# EAGLE design mippe_base (EAGLE 9.4.2)
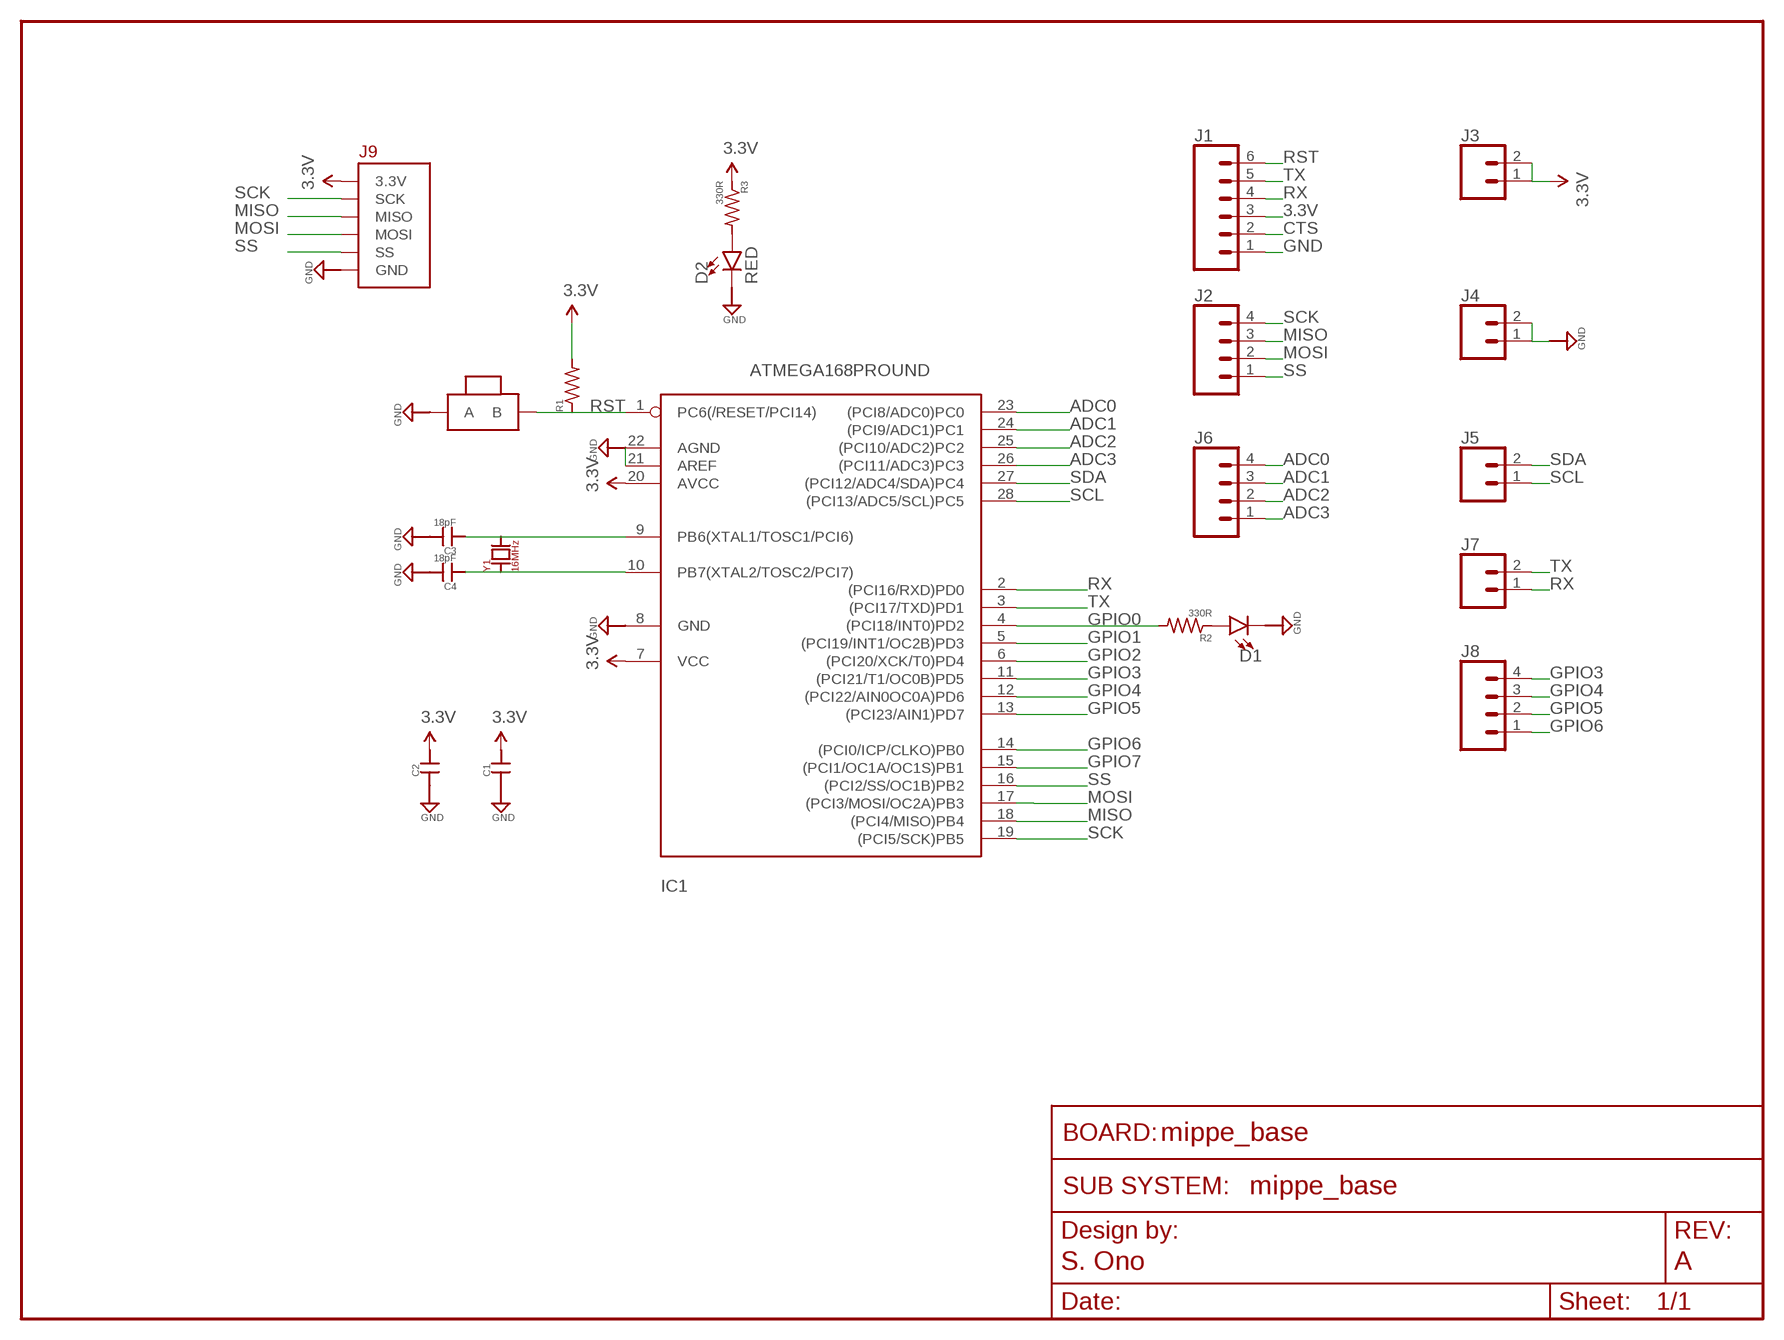
[diagram p0: schematic, sheet 1]
FRAME1 (FRAME_SCHEMATIC): AUTHOR: S. Ono; REV: A; SUBSYSTEM_NAME: mippe_base

## Parts
C1  CAP0603-CAP  [0603-CAP]
C2  CAP0603-CAP  [0603-CAP]
C3  18pF  CAP0603-CAP  [0603-CAP]
C4  18pF  CAP0603-CAP  [0603-CAP]
D1  LED0603  [LED-0603]
D2  RED  LED0603  [LED-0603]
IC1  ATMEGA168PROUND  [DIL28-3-ROUND]
J1  CONN_06NO_SILK_FEMALE_PTH  [1X06_NO_SILK]
J2  CONN_041X04_NO_SILK  [1X04_NO_SILK]
J3  CONN_021X02_NO_SILK  [1X02_NO_SILK]
J4  CONN_021X02_NO_SILK  [1X02_NO_SILK]
J5  CONN_021X02_NO_SILK  [1X02_NO_SILK]
J6  CONN_041X04_NO_SILK  [1X04_NO_SILK]
J7  CONN_021X02_NO_SILK  [1X02_NO_SILK]
J8  CONN_041X04_NO_SILK  [1X04_NO_SILK]
J9  BURNIN  [BURNIN]
R1  R-US_R0603  [R0603]
R2  330R  R-US_R0603  [R0603]
R3  330R  R-US_R0603  [R0603]
SW1  BTN-PTS810  [BTN_PTS810]
Y1  16MHz  CRYSTAL  [HC-49]

## Nets
3.3V: C1.2 C2.2 IC1.7(VCC) IC1.20(AVCC) J1.3 J3.1 J3.2 J9.3.3V R1.2 R3.1
ADC0: IC1.23((PCI8/ADC0)PC0) J6.4
ADC1: IC1.24((PCI9/ADC1)PC1) J6.3
ADC2: IC1.25((PCI10/ADC2)PC2) J6.2
ADC3: IC1.26((PCI11/ADC3)PC3) J6.1
CTS: J1.2
GND: C1.1 C2.1 C3.2 C4.2 D1.C D2.C IC1.8(GND) IC1.21(AREF) IC1.22(AGND) J1.1 J4.1 J4.2 J9.GND SW1.1(A) SW1.2(A)
GPIO0: IC1.4((PCI18/INT0)PD2) R2.2
GPIO1: IC1.5((PCI19/INT1/OC2B)PD3)
GPIO2: IC1.6((PCI20/XCK/T0)PD4)
GPIO3: IC1.11((PCI21/T1/OC0B)PD5) J8.4
GPIO4: IC1.12((PCI22/AIN0OC0A)PD6) J8.3
GPIO5: IC1.13((PCI23/AIN1)PD7) J8.2
GPIO6: IC1.14((PCI0/ICP/CLKO)PB0) J8.1
GPIO7: IC1.15((PCI1/OC1A/OC1S)PB1)
MISO: IC1.18((PCI4/MISO)PB4) J2.3 J9.MISO
MOSI: IC1.17((PCI3/MOSI/OC2A)PB3) J2.2 J9.MOSI
N$1: D1.A R2.1
N$2: D2.A R3.2
N$3: C3.1 IC1.9(PB6(XTAL1/TOSC1/PCI6)) Y1.B
N$4: C4.1 IC1.10(PB7(XTAL2/TOSC2/PCI7)) Y1.A
RST: IC1.1(PC6(/RESET/PCI14)) J1.6 R1.1 SW1.3(B) SW1.4(B)
RX: IC1.2((PCI16/RXD)PD0) J1.4 J7.1
SCK: IC1.19((PCI5/SCK)PB5) J2.4 J9.SCK
SCL: IC1.28((PCI13/ADC5/SCL)PC5) J5.1
SDA: IC1.27((PCI12/ADC4/SDA)PC4) J5.2
SS: IC1.16((PCI2/SS/OC1B)PB2) J2.1 J9.SS
TX: IC1.3((PCI17/TXD)PD1) J1.5 J7.2

## Library data of the parts
C1-C4 = scono:CAP: Capacitor Standard 0603 ceramic capacitor, and 0.1" leaded capacitor.; PIE-INT-REF-NUM: CAPACITOR-GENERIC
D1 D2 = scono:LED: https://www.digikey.com/products/en/optoelectronics/led-indication-discrete/105?k=&pkeyword=&pv7=2&pv1989=0&pv16=5&FV=ffe00069&quantity=0&ColumnSort=0&page=1&pageSize=25
IC1 = scono:ATMEGA168*P: MICROCONTROLLER 16 kBytes FLASH 1 kBytes SRAM 512 Bytes EEPROM USART 8-channel 10 bit ADC
J1 = scono:CONN_06: Multi connection point. Often used as Generic Header-pin footprint for 0.1 inch spaced/style header connections On any of the 0.1 inch spaced packages, you can populate with these: Break Away Headers - Straight <https://www.sparkfun.com/products/116> (PRT-00116) Break Away Male Headers - Right Angle <https://www.sparkfun.com/products/553> (PRT-00553) Female Headers <https://www.sparkfun.com/products/115> (PRT-00115) Break Away Headers - Machine Pin <https://www.sparkfun.com/products/117> (PRT-00117) Break Away Female Headers - Swiss Machine Pin <https://www.sparkfun.com/products/743> (PRT-00743) Arduino Stackable Header - 6 Pin <https://www.sparkfun.com/products/9280> (PRT-09280) For SCREWTERMINALS and SPRING TERMINALS visit here: Screw Terimnals on SparkFun.com <https://www.sparkfun.com/search/results?term=Screw+Terminals> (5mm/3.5mm/2.54mm spacing) This device is also useful as a general connection point to wire up your design to another part of your project. Our various solder wires solder well into these plated through hole pads. Hook-Up Wire - Assortment (Stranded, 22 AWG) <https://www.sparkfun.com/products/11375> (PRT-11375) Hook-Up Wire - Assortment (Solid Core, 22 AWG) <https://www.sparkfun.com/products/11367> (PRT-11367) View the entire wire category on our website here <https://www.sparkfun.com/categories/141>; PROD_ID: CONN-08437
J2 J6 J8 = scono:CONN_04: Multi connection point. Often used as Generic Header-pin footprint for 0.1 inch spaced/style header connections On any of the 0.1 inch spaced packages, you can populate with these: Break Away Headers - Straight <https://www.sparkfun.com/products/116> (PRT-00116) Break Away Male Headers - Right Angle <https://www.sparkfun.com/products/553> (PRT-00553) Female Headers <https://www.sparkfun.com/products/115> (PRT-00115) Break Away Headers - Machine Pin <https://www.sparkfun.com/products/117> (PRT-00117) Break Away Female Headers - Swiss Machine Pin <https://www.sparkfun.com/products/743> (PRT-00743) For SCREWTERMINALS and SPRING TERMINALS visit here: Screw Terimnals on SparkFun.com <https://www.sparkfun.com/search/results?term=Screw+Terminals> (5mm/3.5mm/2.54mm spacing) This device is also useful as a general connection point to wire up your design to another part of your project. Our various solder wires solder well into these plated through hole pads. Hook-Up Wire - Assortment (Stranded, 22 AWG) <https://www.sparkfun.com/products/11375> (PRT-11375) Hook-Up Wire - Assortment (Solid Core, 22 AWG) <https://www.sparkfun.com/products/11367> (PRT-11367) View the entire wire category on our website here <https://www.sparkfun.com/categories/141> Special notes: Molex polarized connector foot print use with SKU : PRT-08231 with associated crimp pins and housings. 1MM SMD Version SKU: PRT-10208; PROD_ID: CONN-09696
J3-J5 J7 = scono:CONN_02: Multi connection point. Often used as Generic Header-pin footprint for 0.1 inch spaced/style header connections On any of the 0.1 inch spaced packages, you can populate with these: Break Away Headers - Straight <https://www.sparkfun.com/products/116> (PRT-00116) Break Away Male Headers - Right Angle <https://www.sparkfun.com/products/553> (PRT-00553) Female Headers <https://www.sparkfun.com/products/115> (PRT-00115) Break Away Headers - Machine Pin <https://www.sparkfun.com/products/117> (PRT-00117) Break Away Female Headers - Swiss Machine Pin <https://www.sparkfun.com/products/743> (PRT-00743) For SCREWTERMINALS and SPRING TERMINALS visit here: Screw Terimnals on SparkFun.com <https://www.sparkfun.com/search/results?term=Screw+Terminals> (5mm/3.5mm/2.54mm spacing) This device is also useful as a general connection point to wire up your design to another part of your project. Our various solder wires solder well into these plated through hole pads. Hook-Up Wire - Assortment (Stranded, 22 AWG) <https://www.sparkfun.com/products/11375> (PRT-11375) Hook-Up Wire - Assortment (Solid Core, 22 AWG) <https://www.sparkfun.com/products/11367> (PRT-11367) View the entire wire category on our website here <https://www.sparkfun.com/categories/141> Special notes: Molex polarized connector foot print use with: PRT-08233 with associated crimp pins and housings. 2.54_SCREWTERM for use with PRT-10571. 3.5mm Screw Terminal footprints for PRT-08084 5mm Screw Terminal footprints for use with PRT-08432
J9 = scono:BURNIN
R1-R3 = scono:R-US_: RESISTOR, American symbol; DESCRIPTION: RESISTOR, American symbol; DISTRIBUTOR: DigiKey; MANUFACTURER: Rohm Semiconductor; NOTES: Cut Tape; PACKAGE: R0603
SW1 = scono:BTN-PTS810: https://www.digikey.com/product-detail/en/c-k/PTS810-SJM-250-SMTR-LFS/CKN10502CT-ND/4176673
Y1 = scono:CRYSTAL

## Board
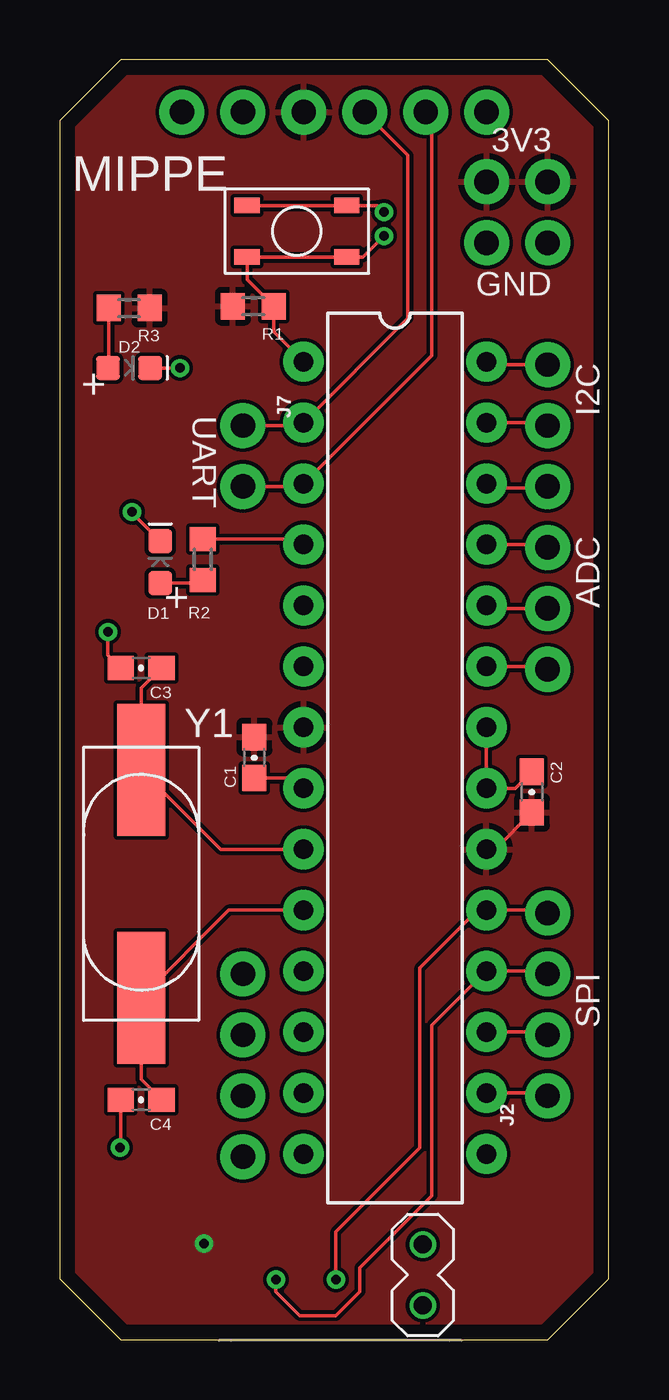
[diagram p1: board, top side]
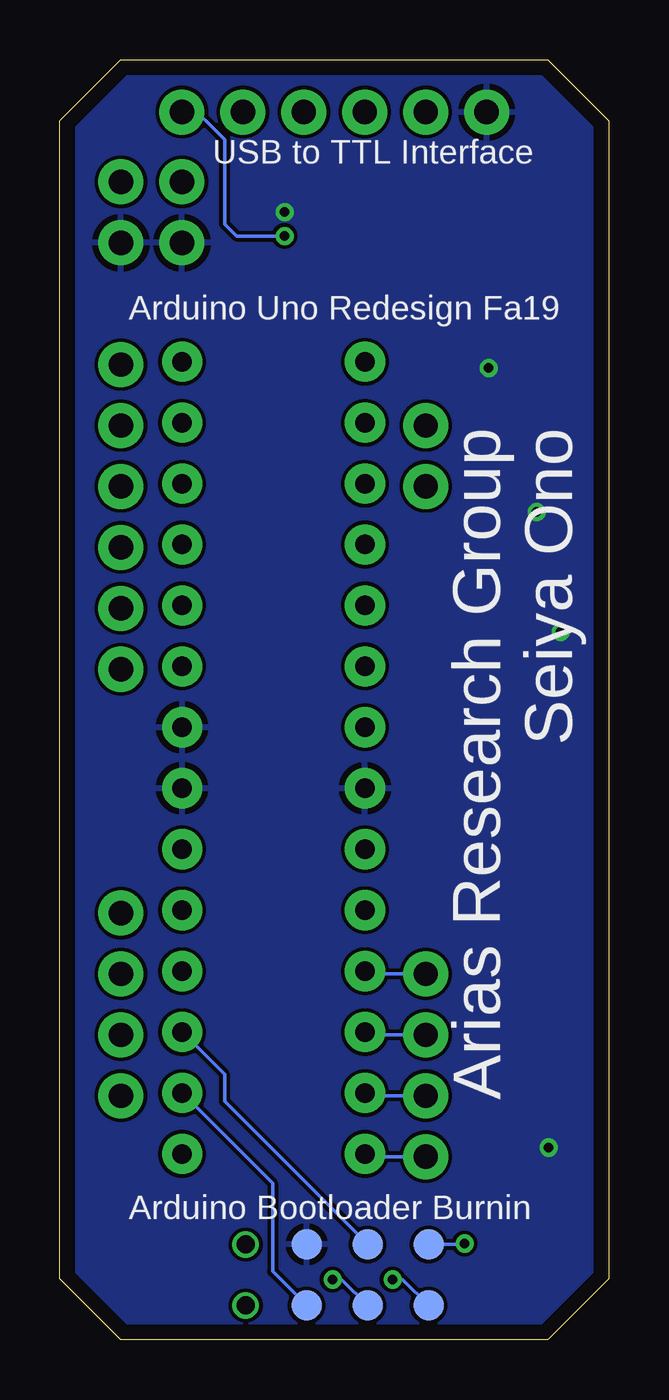
[diagram p2: board, bottom side, seen from below]

Size 22.86 x 53.34 mm. Coordinates in mm from the lower left corner, seen from the top.
Outline: 0,2.54 2.54,0 20.32,0 22.86,2.54 22.86,50.8 20.32,53.34 2.54,53.34 0,50.8 0,2.54
Copper layers (1*16): Top 2mil / dielectric 9mil / Bottom 2mil
Design rules "scono": minimum track width 6mil, minimum drill 15mil, track to track 6mil, track to pad 6mil, pad to pad 6mil, via to via 6mil, smd to smd 6mil, copper to edge 25mil, drill to drill 7mil, minimum pad ring 7mil, minimum via ring 7mil, stop-mask expansion 3mil, vias tented up to drill 0mil, thermal gap 10mil

### Footprints (pad centres in the part's own frame; a part is rotated, then mirrored left to right if it is on the bottom)
0603-CAP = smd 1.1 x 1: 1 -0.85,0; 2 0.85,0
LED-0603 = smd 1 x 1: A -0.877,0; C 0.877,0
DIL28-3-ROUND = drill 0.813 pad 1.676: 1 -16.51,-3.81; 2 -13.97,-3.81; 3 -11.43,-3.81; 4 -8.89,-3.81; 5 -6.35,-3.81; 6 -3.81,-3.81; 7 -1.27,-3.81; 8 1.27,-3.81; 9 3.81,-3.81; 10 6.35,-3.81; 11 8.89,-3.81; 12 11.43,-3.81; 13 13.97,-3.81; 14 16.51,-3.81; 15 16.51,3.81; 16 13.97,3.81; 17 11.43,3.81; 18 8.89,3.81; 19 6.35,3.81; 20 3.81,3.81; 21 1.27,3.81; 22 -1.27,3.81; 23 -3.81,3.81; 24 -6.35,3.81; 25 -8.89,3.81; 26 -11.43,3.81; 27 -13.97,3.81; 28 -16.51,3.81
1X06_NO_SILK = drill 1.016 pad 1.88: 1 0,0; 2 2.54,0; 3 5.08,0; 4 7.62,0; 5 10.16,0; 6 12.7,0
1X04_NO_SILK = drill 1.016 pad 1.88: 1 0,0; 2 2.54,0; 3 5.08,0; 4 7.62,0
1X02_NO_SILK = drill 1.016 pad 1.88: 1 0,0; 2 2.54,0
BURNIN = smd 1.27 x 1.27 bottom: 3.3V 0,0; GND -5.08,0; MISO 0,2.54; MOSI -2.54,0; SCK -2.54,2.54; SS -5.08,2.54 | drill 0.75: P$7 -7.62,2.54; P$8 -7.62,0
R0603 = smd 1 x 1.1: 1 -0.85,0; 2 0.85,0
BTN_PTS810 = smd 1.05 x 0.65: 1 -2.075,1.075; 2 2.075,1.075; 3 -2.075,-1.075; 4 2.075,-1.075
HC-49 = smd 5.5 x 2: A 4.75,0; B -4.75,0

### Placement (x,y rotation side)
C1  8.1,24.26 90 top
C2  19.66,22.82 270 top
C3  3.38,28 180 top
C4  3.38,10 180 top
D1  4.18,32.41 90 top
D2  2.88,40.5 0 top
IC1  13.96,24.25 270 top
J1  5.08,51.16 0 top
J2  20.32,10.16 90 top
J3  20.32,48.26 180 top
J4  20.32,45.72 180 top
J5  20.32,40.64 270 top
J6  20.32,35.56 270 top
J7  7.62,38.1 270 top
J8  7.62,7.62 90 top
J9  7.5,3.96 180 top
R1  8.05,43.07 180 top
R2  5.95,32.52 90 top
R3  2.88,43 180 top
SW1  9.87,46.2 0 top
Y1  3.38,19 270 top

### Tracks (layer width: path | path; a pad name or v marks a point on that pad's centre or on a via)
3.3V  (via drill 0.4)
  Top 0.152: C2.2 18.13,20.44 IC1.20
  Bottom 0.152: J9.3.3V 6.04,3.96 v6,4
  pour Top: 0,50.8 2.54,53.34 20.32,53.34 22.86,50.8 22.86,2.54 20.32,0 2.54,0 0,2.54
ADC0
  Top 0.152: IC1.23 20.2,28.06 J6.4
ADC1
  Top 0.152: J6.3 17.89,30.48 IC1.24
ADC2
  Top 0.152: IC1.25 20.2,33.14 J6.2
ADC3
  Top 0.152: J6.1 20.26,35.5 17.95,35.5 IC1.26
GND  (via drill 0.4)
  Top 0.152: SW1.1 SW1.2 13.22,47.27 v13.5,47 | D2.C v5,40.5 | D1.C 3,34.47 v3,34.5 | C3.2 2,28.53 v2,29.5 | C1.1 9.72,23.41 IC1.8 | C2.1 18.97,22.98 IC1.21 IC1.22 | C4.2 2.53,8.03 v2.5,8
  pour Bottom: 2.54,53.34 20.32,53.34 22.86,50.8 22.86,2.54 20.32,0 2.54,0 0,2.54 0,50.8
GPIO0
  Top 0.152: R2.2 9.92,33.37 IC1.4
GPIO3
  Bottom 0.152: J8.4 10.03,15.24 IC1.11
GPIO4
  Bottom 0.152: J8.3 10.03,12.7 IC1.12
GPIO5
  Bottom 0.152: J8.2 10.03,10.16 IC1.13
GPIO6
  Bottom 0.152: J8.1 10.03,7.62 IC1.14
MISO  (via drill 0.4)
  Top 0.152: J2.3 20.2,15.36 IC1.18 15.5,13.09 15.5,6.5 15.5,6 13,3.5 12.5,3 12.5,2 11.5,1 10,1 9,2 v9,2.5
  Bottom 0.152: v9,2.5 8.58,2.5 J9.MISO
MOSI
  Top 0.152: IC1.17 20.2,12.82 J2.2
  Bottom 0.152: J9.MOSI 16,9.92 16,11.05 IC1.17
N$1
  Top 0.152: D1.A 5.81,31.53 R2.1
N$2
  Top 0.152: R3.2 2.03,40.53 D2.A
N$3
  Top 0.152: C3.1 3.38,27.15 Y1.B 6.69,20.44 IC1.9
N$4
  Top 0.152: IC1.10 7.03,17.9 Y1.A 3.38,10.85 C4.1
RST  (via drill 0.4)
  Top 0.152: IC1.1 8.9,42.01 R1.1 7.79,44.17 SW1.3 SW1.4 12.62,45.12 v13.5,46
  Bottom 0.152: v13.5,46 15.5,46 16,46.5 16,50.02 17.14,51.16 J1.6
RX
  Top 0.152: J7.1 10.03,38.1 IC1.2 14.5,42.57 14.5,48.9 14.5,49.37 J1.4
SCK  (via drill 0.4)
  Top 0.152: J2.4 20.2,17.9 IC1.19 17.4,17.9 15,15.5 15,8 11.5,4.5 v11.5,2.5
  Bottom 0.152: J9.SCK 11.12,2.5 v11.5,2.5
SCL
  Top 0.152: J5.1 17.89,40.64 IC1.28
SDA
  Top 0.152: IC1.27 20.2,38.22 J5.2
SS
  Top 0.152: IC1.16 20.2,10.28 J2.1
  Bottom 0.152: IC1.16 14,6.51 14,2.84 J9.SS
TX
  Top 0.152: J7.2 10.03,35.56 IC1.3 15.49,41.02 | 15.49,41.02 15.5,41.03 | 15.5,50.91 J1.5 15.49,50.91 15.49,41.02

### Text on the board
tPlace: 3V3 | MIPPE | GND | UART | I2C | ADC | SPI
bPlace: USB to TTL Interface | Arduino Uno Redesign Fa19 | Arias Research Group / Seiya Ono | Arduino Bootloader Burnin